# Altium schematic sheet Bedside Lamp V2.0.SchDoc
size A4
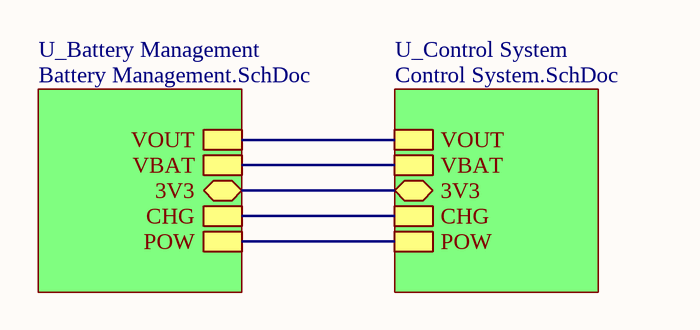
[diagram p0: Bedside Lamp V2.0.SchDoc]

## Sub-sheets
U_Battery Management = Battery Management.SchDoc: POW, CHG, VOUT, VBAT, 3V3
U_Control System = Control System.SchDoc: POW, VBAT, VOUT, CHG, 3V3

## Nets
(unnamed): sheet U_Control System/POW, sheet U_Battery Management/POW
(unnamed): sheet U_Control System/VBAT, sheet U_Battery Management/VBAT
(unnamed): sheet U_Control System/VOUT, sheet U_Battery Management/VOUT
(unnamed): sheet U_Control System/CHG, sheet U_Battery Management/CHG
(unnamed): sheet U_Control System/3V3, sheet U_Battery Management/3V3